# EAGLE design Grove- Moisture Sensor (EAGLE 5.10)
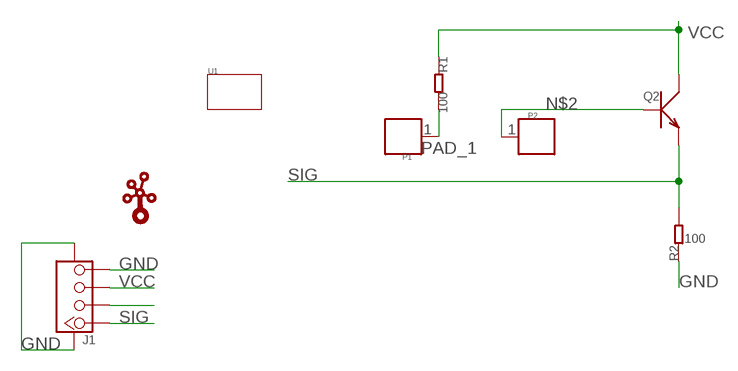
[diagram p0: schematic, sheet 1]

## Parts
J1  TWIG-4P-2.0-SMD-FEMALE-REINFORCE'90D'  [4P-SMD-2.0-90D]
P1  PAD.03  [1P-SMD-0.76X0.76]
P2  PAD.03  [1P-SMD-0.76X0.76]
Q2  TRANSISTOR-NPN-SOT23''  [SOT23]
R1  100  R-0603  [0603]
R2  100  R-0603  [0603]
U1  TWIG'SPECIAL'  [3U-DIM-W/-DRILL-SPECIAL]
U$1  LOGO-TWIG  [TWIGLOGO]

## Nets
GND: J1.4 J1.SS1 J1.SS2 R2.1
N$2: P2.1 Q2.1(B)
N$4: J1.2
PAD_1: P1.1 R1.2
SIG: J1.1 Q2.2(E) R2.2
VCC: J1.3 Q2.3(C) R1.1

## Library data of the parts
J1 = Connector:TWIG-4P-2.0-SMD-FEMALE-REINFORCE
P1 P2 = Discrete:PAD
Q2 = Discrete:TRANSISTOR-NPN*: NPN audion
R1 R2 = Discrete:R*
U1 = Module:TWIG
U$1 = Logo:LOGO-TWIG

## Board
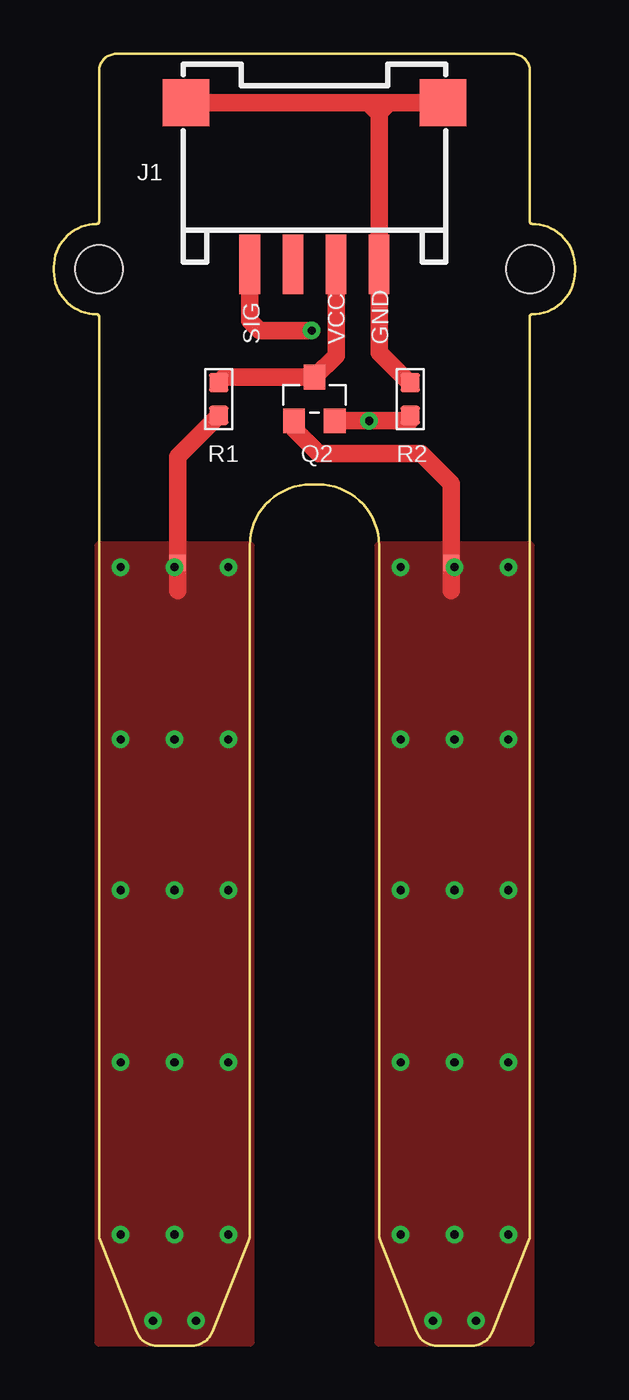
[diagram p1: board, top side]
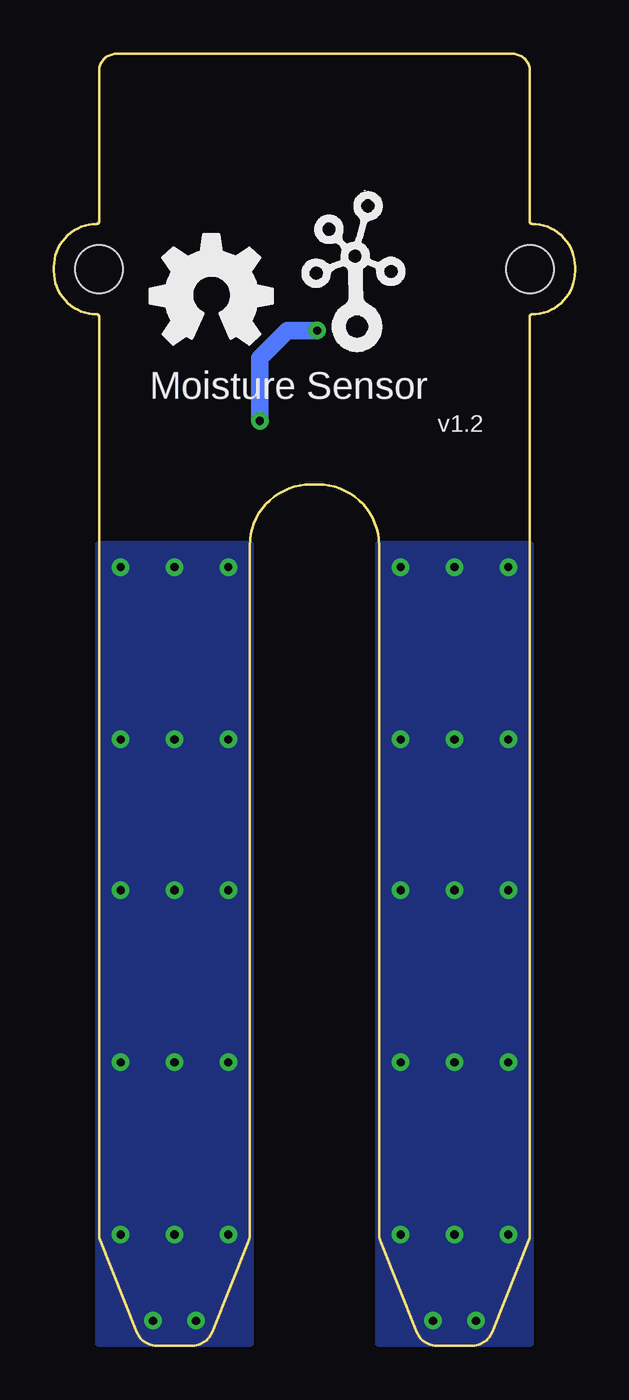
[diagram p2: board, bottom side, seen from below]

Size 24.2 x 60 mm. Coordinates in mm from the lower left corner, seen from the top.
Copper layers (1*16): Top 0.035mm / dielectric 1.5mm / Bottom 0.035mm
Design rules: minimum track width 10mil, minimum drill 12mil, track to track 8mil, track to pad 8mil, pad to pad 8mil, via to via 8mil, smd to smd 8mil, copper to edge 0mil, drill to drill 8mil, minimum pad ring 10mil, minimum via ring 8mil, stop-mask expansion 4mil, vias tented up to drill 25mil, thermal gap 10mil

### Footprints (pad centres in the part's own frame; a part is rotated, then mirrored left to right if it is on the bottom)
4P-SMD-2.0-90D = smd 0.965 x 2.74: 1 -3,-0.1; 2 -1,-0.1; 3 1,-0.1; 4 3,-0.1 | smd 2.159 x 2.184: SS1 -5.974,7.4; SS2 5.974,7.4
1P-SMD-0.76X0.76 = smd 0.762 x 0.762: 1 0,0
SOT23 = smd 1.016 x 1.143: 1 -0.95,-1.016; 2 0.95,-1.016; 3 0,1.016
0603 = smd 0.889 x 0.889: 1 -0.762,0; 2 0.762,0
3U-DIM-W/-DRILL-SPECIAL = hole 2.2: 10,20; -10,20

### Placement (x,y rotation side)
J1  12.1,50.32 0 top
P1  5.75,36.35 0 top
P2  18.45,36.35 0 top
Q2  12.1,43.97 0 top
R1  7.65,43.97 270 top
R2  16.55,43.97 270 top
U1  12.1,30 0 top
U$1  10.18,47.13 0 bottom
U$2  [OSHW_FILLX200_NOTEXT]  19.72,46.51 0 bottom

### Tracks (layer width: path | path; a pad name or v marks a point on that pad's centre or on a via)
GND
  Top 0.813: R2.1 16.55,44.68 15.1,46.13 J1.4 15.1,56.77 15.1,57.23 | 15.27,57.72 J1.SS1 | 15.27,57.72 J1.SS2 | 15.1,57.23 15.1,57.55 15.27,57.72 | 15.1,57.23 14.64,57.69 | 15.1,57.23 15.1,57.26 15.53,57.69
N$2  (via drill 0.38 pad 0.81)
  Top 0.813: 18.45,35.08 P2.1 18.45,40.03 17.05,41.43 12.29,41.43 11.15,42.57 Q2.1
  other vias: 17.6,1.16 19.6,1.16 16.1,5.16 18.6,5.16 21.1,5.16 16.1,36.16 18.6,36.16 21.1,36.16 16.1,28.16 18.6,28.16 21.1,28.16 16.1,21.16 18.6,21.16 21.1,21.16 16.1,13.16 18.6,13.16 21.1,13.16
  pour Top (no thermals): 15.1,37.16 22.1,37.16 22.1,0.16 15.1,0.16
  pour Bottom (no thermals): 15.1,37.16 22.1,37.16 22.1,0.16 15.1,0.16
PAD_1  (via drill 0.38 pad 0.81)
  Top 0.813: 5.75,35.08 P1.1 5.75,41.3 R1.2
  other vias: 4.6,1.16 6.6,1.16 3.1,36.16 5.6,36.16 8.1,36.16 5.6,28.16 8.1,28.16 8.1,21.16 5.6,21.16 3.1,5.16 3.1,13.16 3.1,21.16 3.1,28.16 5.6,13.16 8.1,13.16 5.6,5.16 8.1,5.16
  pour Top (no thermals): 2.1,37.16 9.1,37.16 9.1,0.16 2.1,0.16
  pour Bottom (no thermals): 2.1,37.16 9.1,37.16 9.1,0.16 2.1,0.16
SIG  (via drill 0.38 pad 0.81)
  Top 0.813: Q2.2 v14.64,42.95 16.55,42.95 R2.2 | J1.1 9.1,47.6 9.56,47.14 v11.97,47.14
  Bottom 0.813: v11.97,47.14 13.37,47.14 14.64,45.88 v14.64,42.95
VCC
  Top 0.813: J1.3 13.1,45.99 Q2.3 7.91,44.99 R1.1

### Text on the board
tPlace: SIG | VCC | GND
bPlace: Moisture Sensor | v1.2